# Altium schematic sheet POWER_FLASH_POWER_MANAGE.SchDoc
size A4; SheetNumber: 13; SheetTotal: 20
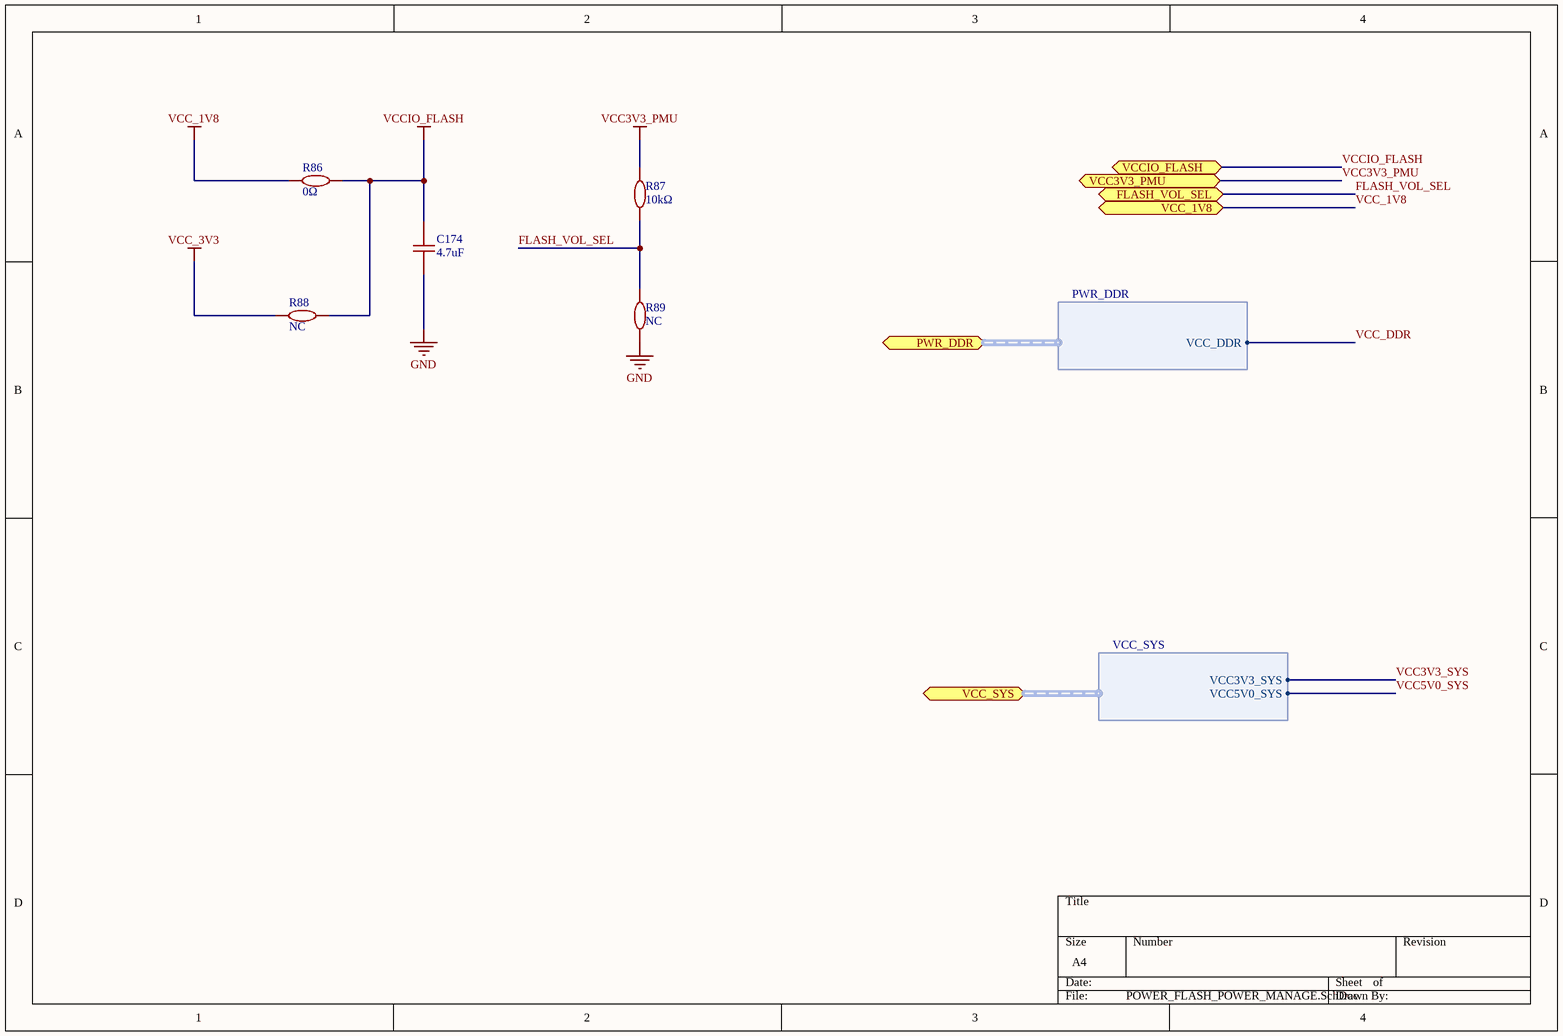
[diagram p0: POWER_FLASH_POWER_MANAGE.SchDoc]

## Parts
C174  4.7uF  [C0402]
R86  0Ω  [R0402]
R87  10kΩ  [R0402]
R88  NC  [R0402]
R89  NC  [R0402]

## Ports
FLASH_VOL_SEL (bidir, see POWER[6D], RK3566[3D], RK3566_OSC_PLL_PMUO1_2[2B]), PWR_DDR (bidir, harness PWR_DDR, see POWER[6D], POWER[3D], POWER_PMIC[2D], RK3566[2A], RK3566_DDR_PHY[1A]), VCC3V3_PMU (bidir, see POWER[7C], POWER_EXTENSION[1A], POWER_PMIC[7D]), VCC_1V8 (bidir, see POWER[7C], POWER_PMIC[7A]), VCC_SYS (bidir, harness VCC_SYS, see POWER[7C], Audio_AND_HPJ[3A], DEBUG_AND_GPIO[1D], HDMI[2C], MIPI_DSI_TP[6A], POWER[3B], POWER[6B], POWER_EXTENSION[4D], POWER_PMIC[6D], Wi-Fi_BT[3D]), VCCIO_FLASH (bidir, see POWER[7D], RK3566[3B], RK3566_FLASH_SD_SARADC[7C])

## Harnesses
PWR_DDR: VCC_DDR
VCC_SYS: VCC3V3_SYS, VCC5V0_SYS

## Nets
GND: C174.1 R89.1
VCC3V3_PMU: R87.2 ; port VCC3V3_PMU
VCC_1V8: R86.1 ; port VCC_1V8
VCC_3V3: R88.1
VCCIO_FLASH: C174.2 R86.2 R88.2 ; port VCCIO_FLASH
FLASH_VOL_SEL: R87.1 R89.2 ; port FLASH_VOL_SEL
VCC3V3_SYS: port VCC_SYS.VCC3V3_SYS
VCC5V0_SYS: port VCC_SYS.VCC5V0_SYS
VCC_DDR: port PWR_DDR.VCC_DDR

## Library data of the parts
C174 = 4.7uF: 10V 4.7uF X5R ±20% 0402 Ceramic Capacitors ROHS
R86 R88 R89 = 0Ω: 0Ω 62.5mW 50V Thick Film Resistor ±1% 0402 Chip Resistor - Surface Mount ROHS
R87 = 10kΩ: 62.5mW 10kΩ 50V ±100ppm/℃ Thick Film Resistor ±1% 0402 Chip Resistor - Surface Mount ROHS